# Altium schematic sheet AUX DAQ.SchDoc: ADC Mapping
size A4; DrawnBy: Glenn Zhang; Revision: 1.0; SheetNumber: 2; SheetTotal: 2
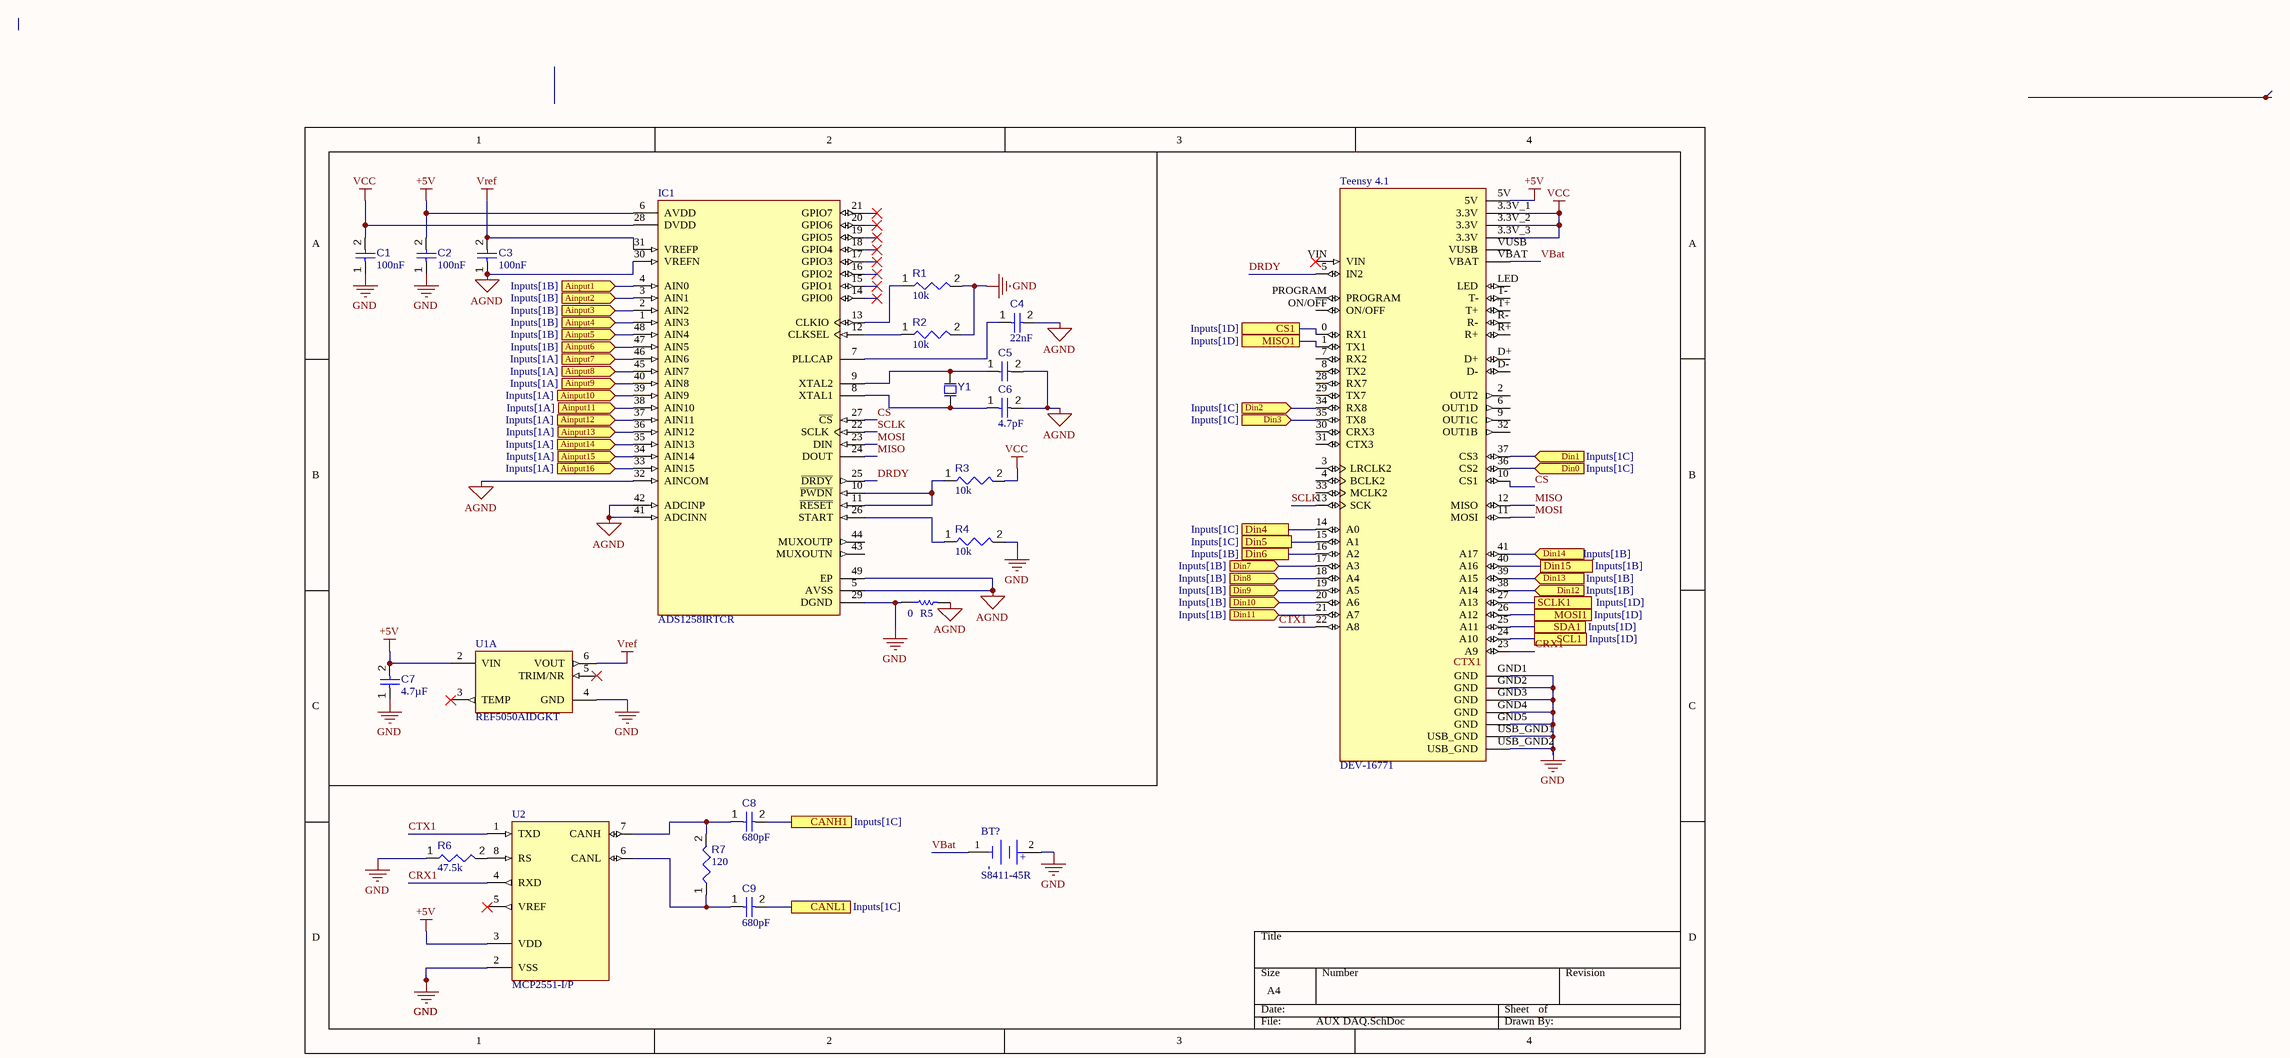
[diagram p0: AUX DAQ.SchDoc]

## Parts
BT?  S8411-45R  [FP-S8411-45R-MFG]
C1  value 100nF  [CAPC0402(1005)60_L]  (hidden comment: Capacitor 100nF +/-20% 50V 0402)
C2  value 100nF  [CAPC0402(1005)60_L]  (hidden comment: Capacitor 100nF +/-20% 50V 0402)
C3  value 100nF  [CAPC0402(1005)60_L]  (hidden comment: Capacitor 100nF +/-20% 50V 0402)
C4  value 22nF  [CAPC0402(1005)60_L]  (hidden comment: Capacitor 22nF +/-20% 10V 0402)
C5  C0402C479C5GACTU  [CAPC1005X55N]  (value not drawn)
C6  value 4.7pF  [CAPC1005X55N]  (hidden comment: C0402C479C5GACTU)
C7  value 4.7µF  [CAPC0805(2012)145_L]  (hidden comment: Capacitor 4.7µF +/-40% 25V 0805)
C8  value 680pF  [CAPC0402(1005)33_L]  (hidden comment: Capacitor 680pF +/-20% 50V 0402)
C9  value 680pF  [CAPC0402(1005)33_L]  (hidden comment: Capacitor 680pF +/-20% 50V 0402)
IC1  ADS1258IRTCR  [FP-RTC0048A-IPC_C]
R1  value 10k  [RESC0402(1005)_L]  (hidden comment: 10KR2F)
R2  value 10k  [RESC0402(1005)_L]  (hidden comment: 10KR2F)
R3  value 10k  [RESC0402(1005)_L]  (hidden comment: 10KR2F)
R4  value 10k  [RESC0402(1005)_L]  (hidden comment: 10KR2F)
R5  value 0  [RESC1005X40X25ML05T10]  (hidden comment: Resistor 0R 0402 63 mW)
R6  value 47.5k  [RESC0402(1005)_L]  (hidden comment: 47D5KR2F)
R7  value 120  [RESC0603(1608)_L]  (hidden comment: Resistor 120R +/-5 % 0603 0.1 W)
Teensy_4.1  DEV-16771  [MODULE_DEV-16771]  (no BOM)
U1  REF5050AIDGKT  [DGK0008A_M]  (part A of 2)
U2  MCP2551-I/P  [PDIP300-P8]
Y1  ABS07-166-32.768KHZ-T  [EPSON-FC-135_V]  (value not drawn)

## Ports
Ainput1 (in, see Inputs[1B]), Ainput2 (in, see Inputs[1B]), Ainput3 (in, see Inputs[1B]), Ainput4 (in, see Inputs[1B]), Ainput5 (in, see Inputs[1B]), Ainput6 (in, see Inputs[1B]), Ainput7 (in, see Inputs[1A]), Ainput8 (in, see Inputs[1A]), Ainput9 (in, see Inputs[1A]), Ainput10 (in, see Inputs[1A]), Ainput11 (in, see Inputs[1A]), Ainput12 (in, see Inputs[1A]), Ainput13 (in, see Inputs[1A]), Ainput14 (in, see Inputs[1A]), Ainput15 (in, see Inputs[1A]), Ainput16 (in, see Inputs[1A]), CANH1 (see Inputs[1C]), CANL1 (see Inputs[1C]), CS1 (see Inputs[1D]), Din0 (in, see Inputs[1C]), Din1 (in, see Inputs[1C]), Din2 (in, see Inputs[1C]), Din3 (in, see Inputs[1C]), Din4 (see Inputs[1C]), Din5 (see Inputs[1C]), Din6 (see Inputs[1B]), Din7 (in, see Inputs[1B]), Din8 (in, see Inputs[1B]), Din9 (in, see Inputs[1B]), Din10 (in, see Inputs[1B]), Din11 (in, see Inputs[1B]), Din12 (in, see Inputs[1B]), Din13 (in, see Inputs[1B]), Din14 (in, see Inputs[1B]), Din15 (see Inputs[1B]), MISO1 (see Inputs[1D]), MOSI1 (see Inputs[1D]), SCL1 (see Inputs[1D]), SCLK1 (see Inputs[1D]), SDA1 (see Inputs[1D])

## Nets
+5V: C2.2 C7.2 IC1.6(AVDD) Teensy_4.1.5V U1.2(VIN) U2.3(VDD)
AGND: C3.1 C4.2 C5.2 C6.2 IC1.5(AVSS) IC1.30(VREFN) IC1.32(AINCOM) IC1.41(ADCINN) IC1.42(ADCINP) IC1.49(EP) R5.2
GND: BT?.2(A) C1.1 C2.1 C7.1 IC1.29(DGND) R1.2 R2.2 R4.2 R5.1 R6.1 Teensy_4.1.GND1(GND) Teensy_4.1.GND2(GND) Teensy_4.1.GND3(GND) Teensy_4.1.GND4(GND) Teensy_4.1.GND5(GND) Teensy_4.1.USB_GND1(USB_GND) Teensy_4.1.USB_GND2(USB_GND) U1.4(GND) U2.2(VSS)
VCC: C1.2 IC1.28(DVDD) R3.2 Teensy_4.1.3.3V_1(3.3V) Teensy_4.1.3.3V_2(3.3V) Teensy_4.1.3.3V_3(3.3V)
Vref: C3.2 IC1.31(VREFP) U1.6(VOUT)
Ainput1: IC1.4(AIN0) ; port Ainput1
Ainput2: IC1.3(AIN1) ; port Ainput2
Ainput3: IC1.2(AIN2) ; port Ainput3
Ainput4: IC1.1(AIN3) ; port Ainput4
Ainput5: IC1.48(AIN4) ; port Ainput5
Ainput6: IC1.47(AIN5) ; port Ainput6
Ainput7: IC1.46(AIN6) ; port Ainput7
Ainput8: IC1.45(AIN7) ; port Ainput8
Ainput9: IC1.40(AIN8) ; port Ainput9
Ainput10: IC1.39(AIN9) ; port Ainput10
Ainput11: IC1.38(AIN10) ; port Ainput11
Ainput12: IC1.37(AIN11) ; port Ainput12
Ainput13: IC1.36(AIN12) ; port Ainput13
Ainput14: IC1.35(AIN13) ; port Ainput14
Ainput15: IC1.34(AIN14) ; port Ainput15
Ainput16: IC1.33(AIN15) ; port Ainput16
CANH1: C8.2 ; port CANH1
CANL1: C9.2 ; port CANL1
CRX1: Teensy_4.1.23(A9) U2.4(RXD)
CS: IC1.27(~{CS}) Teensy_4.1.10(CS1)
CS1: Teensy_4.1.0(RX1) ; port CS1
CTX1: Teensy_4.1.22(A8) U2.1(TXD)
Din0: Teensy_4.1.36(CS2) ; port Din0
Din1: Teensy_4.1.37(CS3) ; port Din1
Din2: Teensy_4.1.34(RX8) ; port Din2
Din3: Teensy_4.1.35(TX8) ; port Din3
Din4: Teensy_4.1.14(A0) ; port Din4
Din5: Teensy_4.1.15(A1) ; port Din5
Din6: Teensy_4.1.16(A2) ; port Din6
Din7: Teensy_4.1.17(A3) ; port Din7
Din8: Teensy_4.1.18(A4) ; port Din8
Din9: Teensy_4.1.19(A5) ; port Din9
Din10: Teensy_4.1.20(A6) ; port Din10
Din11: Teensy_4.1.21(A7) ; port Din11
Din12: Teensy_4.1.38(A14) ; port Din12
Din13: Teensy_4.1.39(A15) ; port Din13
Din14: Teensy_4.1.41(A17) ; port Din14
Din15: Teensy_4.1.40(A16) ; port Din15
DRDY: IC1.25(~{DRDY}) Teensy_4.1.5(IN2)
MISO: IC1.24(DOUT) Teensy_4.1.12(MISO)
MISO1: Teensy_4.1.1(TX1) ; port MISO1
MOSI: IC1.23(DIN) Teensy_4.1.11(MOSI)
MOSI1: Teensy_4.1.26(A12) ; port MOSI1
SCL1: Teensy_4.1.24(A10) ; port SCL1
SCLK: IC1.22(SCLK) Teensy_4.1.13(SCK)
SCLK1: Teensy_4.1.27(A13) ; port SCLK1
SDA1: Teensy_4.1.25(A11) ; port SDA1
VBat: BT?.1(C) Teensy_4.1.VBAT
NetC4_1: C4.1 IC1.7(PLLCAP)
NetC5_1: C5.1 IC1.9(XTAL2) Y1.2
NetC6_1: C6.1 IC1.8(XTAL1) Y1.1
NetC8_1: C8.1 R7.2 U2.7(CANH)
NetC9_1: C9.1 R7.1 U2.6(CANL)
NetIC1_10: IC1.10(~{PWDN}) IC1.11(~{RESET}) R3.1
NetIC1_12: IC1.12(CLKSEL) R2.1
NetIC1_13: IC1.13(CLKIO) R1.1
NetIC1_26: IC1.26(START) R4.1
NetR6_2: R6.2 U2.8(RS)

Not connected (* = marked no-connect by the designer): IC1 14(GPIO0)* 15(GPIO1)* 16(GPIO2)* 17(GPIO3)* 18(GPIO4)* 19(GPIO5)* 20(GPIO6)* 21(GPIO7)* 43(MUXOUTN) 44(MUXOUTP); Teensy_4.1 2(OUT2) 3(LRCLK2) 4(BCLK2) 6(OUT1D) 7(RX2) 8(TX2) 9(OUT1C) 28(RX7) 29(TX7) 30(CRX3) 31(CTX3) 32(OUT1B) 33(MCLK2) D+ D- LED ON/OFF PROGRAM R+ R- T+ T- VIN* VUSB; U1 3(TEMP)* 5(TRIM/NR)*; U2 5(VREF)*

## Notes on the sheet
- Labels drawn without touching a wire or pin: CTX1
- (in symbol CMP-15817-000007-1) +; -

## Library data of the parts
BT? = CMP-15817-000007-1: BATTERY HOLDER COIN 12MM SMD; Number of Batteries: 1; Material: Polyphenylene; Case/Package: SMD/SMT; Number of Cells: 1; Min Operating Temperature: -55°C; Termination: SMD/SMT; REACH SVHC: No SVHC; Contact Plating: Bronze; Package Quantity: 500; Max Operating Temperature: 105°C; Mount: Surface Mount; Packaging: Tape and Reel
C1-C3 = CMP-001-00067-3: Chip Capacitor, 100nF +/-20%, 50V, 0402, Thickness 0.6 mm; Tolerance: 10%; Min Operating Temperature: -55°C; Pins: 2; Case/Package: 0402; Max Operating Temperature: 85°C; Voltage Rating: 50V; Mounting Technology: SMT
C4 = CMP-001-00062-3: Chip Capacitor, 22nF +/-20%, 10V, 0402, Thickness 0.6 mm; Tolerance: 10%; Min Operating Temperature: -55°C; Case/Package: 0402; Pins: 2; Max Operating Temperature: 85°C; Mounting Technology: SMT; Voltage Rating: 10V
C5 = CMP-001-00083-2: Ceramic Capacitor, Multilayer, Ceramic, 50V, 5.32% +Tol, 5.32% -Tol, C0G, 30ppm/Cel TC, 0.0000047uF, Surface Mount, 0402; Value: 4.7pF; Max Operating Temperature: 125°C; Pins: 2; Min Operating Temperature: -55°C; Capacitor Type: Ceramic; Mounting Technology: Surface Mount; RoHS Compliant: Yes; Case/Package: 0402
C6 = CMP-001-00083-2: Ceramic Capacitor, Multilayer, Ceramic, 50V, 5.32% +Tol, 5.32% -Tol, C0G, 30ppm/Cel TC, 0.0000047uF, Surface Mount, 0402; Max Operating Temperature: 125°C; Pins: 2; Min Operating Temperature: -55°C; Capacitor Type: Ceramic; Mounting Technology: Surface Mount; RoHS Compliant: Yes; Case/Package: 0402
C7 = CMP-001-00080-4: Chip Capacitor, 4.7µF +/-40%, 25V, 0805, Thickness 1.45 mm; Tolerance: 20%; Voltage Rating: 25V; Min Operating Temperature: -55°C; Max Operating Temperature: 85°C; Pins: 2; Mounting Technology: SMT; Case/Package: 0805
C8 C9 = CMP-001-00070-3: Chip Capacitor, 680pF +/-20%, 50V, 0402, Thickness 0.33 mm; Tolerance: 10%; Max Operating Temperature: 85°C; Pins: 2; Min Operating Temperature: -55°C; Voltage Rating: 50V; Mounting Technology: SMT; Case/Package: 0402
IC1 = CMP-031-00009-1: ADC, Delta-Sigma, 24-Bit, 1 Func, 16 Channel, Serial Access, PQCC48; Min Operating Temperature: -40°C; RoHS Compliant: Yes; Case/Package: HVQCCN; Pins: 48; Max Operating Temperature: 105°C
R1-R4 = CMP-009-00066-2: 10K 0.063W 1% 0402 (1005 Metric)  SMD; Power: 63mW; Case/Package: 0402; Mounting Technology: SMT; Pins: 2; Tolerance: 1%
R5 = CMP-009-00004-5: Chip Resistor, 0 Ohm, 0.063 W, -55 to 155 degC, 0402 (1005 Metric); Power: 63mW; Voltage Rating: 50V; Max Operating Temperature: 155°C; Pins: 2; RoHS Compliant: True; Min Operating Temperature: -55°C; Mounting Technology: SM; Case/Package: 0402
R6 = CMP-009-00103-2: 47K5 0.063W 1% 0402 (1005 Metric)  SMD; Power: 63mW; Pins: 2; Tolerance: 1%; Mounting Technology: SMT; Case/Package: 0402
R7 = CMP-009-00176-3: Chip Resistor, 120 Ohms, +/-5 %, 0.1 W, -55 to 155 degC, 0603; Power: 100mW; Tolerance: 5%; Max Operating Temperature: 155°C; Pins: 2; Case/Package: 0603; Min Operating Temperature: -55°C
Teensy_4.1 = CMP-003-000000-1: RT1062 Teensy 4.1 series ARM?Cortex?M7 MPU Embedded Evaluation Board; MF: SparkFun Electronics; Value: *; Source: DEV-16771.SchLib; Pin Count: 65; Package: None; MP: DEV-16771; Design Item ID: DEV-16771; Check_prices: https://www.snapeda.com/parts/DEV-16771/SparkFun+Electronics/view-part/?ref=eda; SnapEDA_Link: https://www.snapeda.com/parts/DEV-16771/SparkFun+Electronics/view-part/?ref=snap; Component Type: Standard
U1 = CMP-00030-00001-1: Three Terminal Voltage Reference, 1 Output, 5V, Trim/Adjustable, PDSO8; Max Operating Temperature: 125°C; Pins: 8; Min Operating Temperature: -40°C; RoHS Compliant: Yes; Case/Package: TSSOP
U2 = CMP-031-00006-1: CAN Transceiver, 1-Trnsvr, PDIP8; RoHS Compliant: Yes; Min Operating Temperature: -40°C; Case/Package: DIP; Pins: 8; Max Operating Temperature: 85°C
Y1 = CMP-003-00029-1: Crystal 32.768kHz 10ppm 7pF -40C +85C; Pins: 2; Frequency: 32.768kHz